# Altium schematic sheet K3-2235D-F11_K3-2235D-F1.schdoc
size 124 x 101 mm
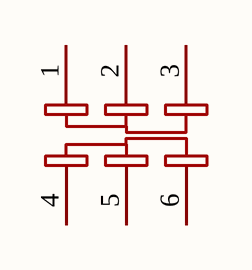
[diagram p0: K3-2235D-F11_K3-2235D-F1.schdoc]

## Parts
SW?  K3-2235D-F1  [SW-TH_K3-2235D-F1]  (value not drawn)

## Nets

Not connected (* = marked no-connect by the designer): SW? 1 2 3 4 5 6

## Library data of the parts
SW? = K3-2235D-F1: Manufacturer: 韩国韩荣; Add into BOM: yes; Circuit: DPDT; Actuator Style: Rectangular columnar; Pin Style: PCPin; Switch Length: 9mm; Switch Width: 3.5mm; Actuator Color: Black; Current Rating (DC): 300mA; Voltage Rating (DC): 6V; Mechanical Life: 1万次; Symbol: K3-2235D-F1; Device: K3-2235D-F1; LCSC Part Name: 直插双档 滑动开关; Supplier Part: C189615; Manufacturer Part: K3-2235D-F1; Supplier Footprint: 插件; JLCPCB Part Class: Extended Part; Datasheet: https://atta.szlcsc.com/upload/public/pdf/source/20210810/9F56F04DF7CBA8FC4D1B091DF1444945.pdf; Supplier: LCSC; Convert to PCB: yes; Switch Height: 3.5mm; Mounting Style: Straight; Current Rating (AC): -; Voltage Rating (AC): -; Operating Temperature: -25℃~+80℃